# Altium schematic sheet Hambmark_PCB-practice-STM32-two-wheel-balancing-car__OTHER_SCHDOC__LM7805CTG.schdoc
size 57 x 35 mm
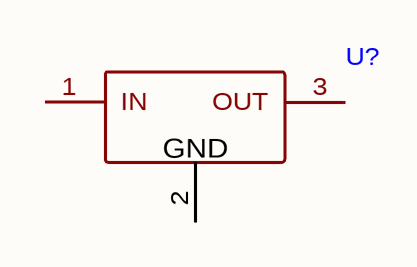
[diagram p0: Hambmark_PCB-practice-STM32-two-wheel-balancing-car__OTHER_SCHDOC__LM7805CTG.schdoc]

## Parts
U?  (no value)  [TO-220-3_L10.2-W4.5-P2.54-L]

## Nets

Not connected (* = marked no-connect by the designer): U? 1(IN) 2(GND) 3(OUT)

## Library data of the parts
U? = LM7805CTG